# Altium schematic sheet 11_WIFI_BLE_Module.SchDoc: WIFI_BLE_Module
size 420 x 297 mm; Author: Lukas Henkel; DocumentNumber: 11; SheetNumber: 11; SheetTotal: 16; DocSize: A3
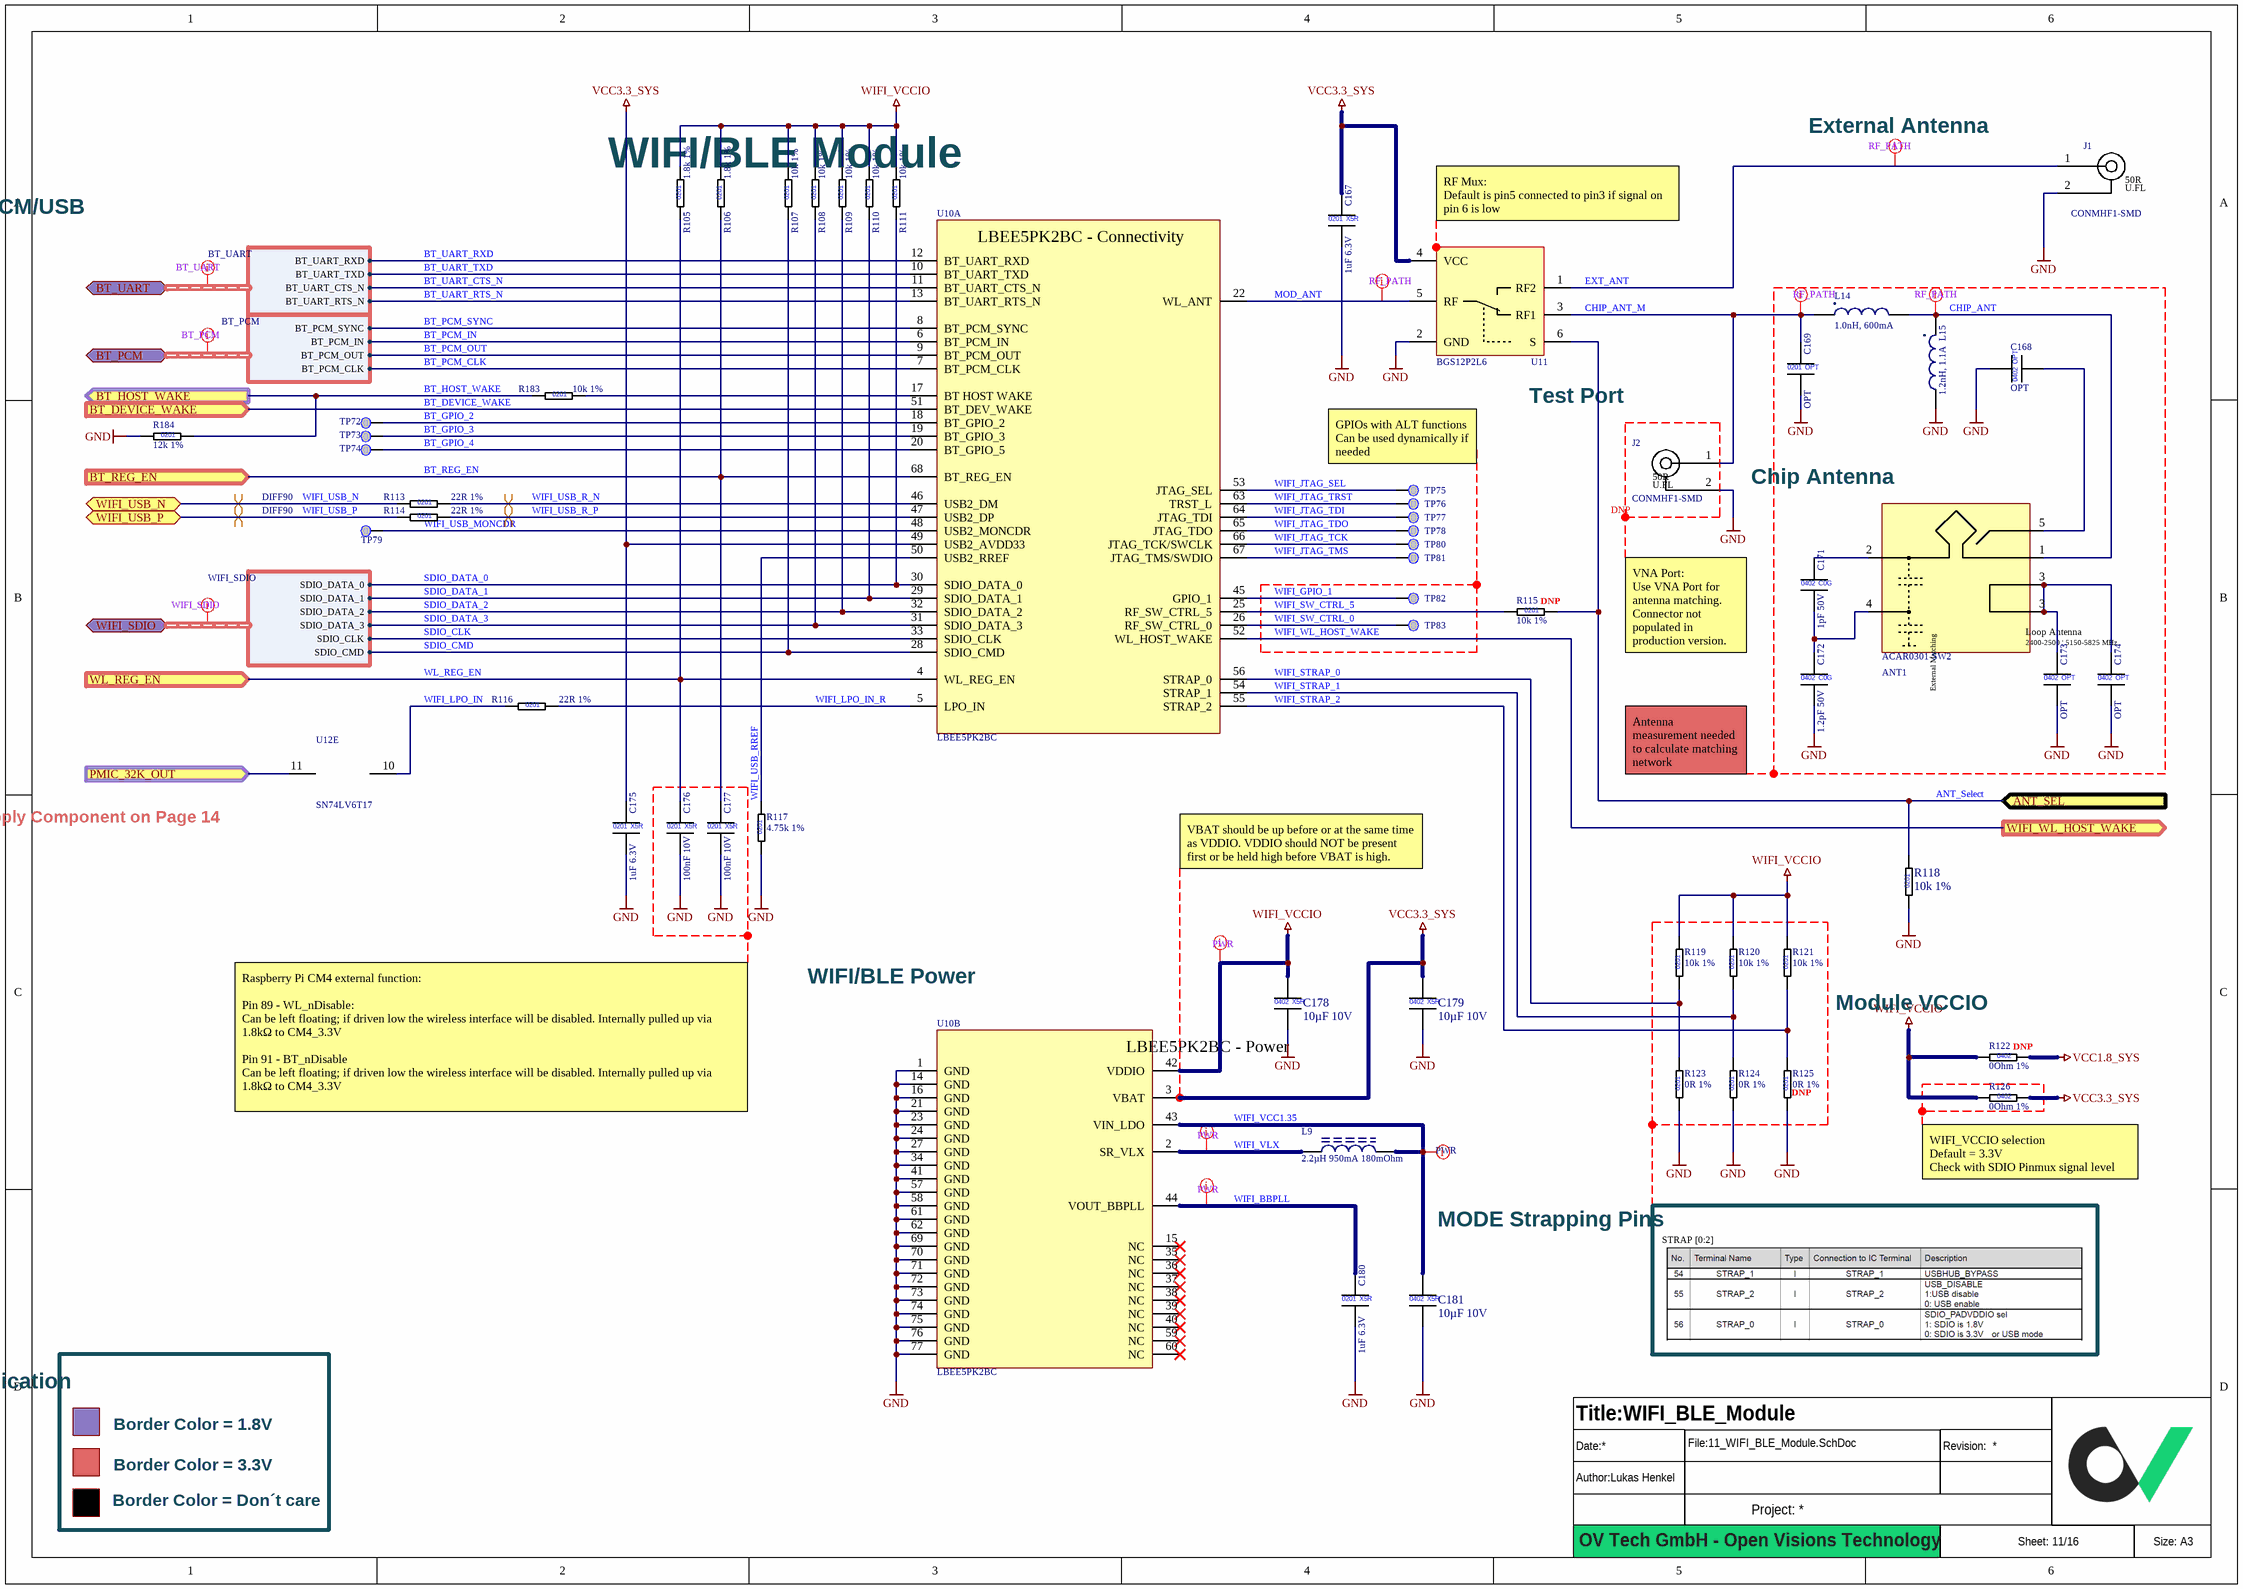
[diagram p0: 11_WIFI_BLE_Module.SchDoc]

## Parts
?  (no value)  (graphical)
ANT1  ACAR0301-SW2  [ANTENNA_ACAR0301-SW2]
C167  1uF 6.3V  [CAPC0603X03L]
C168  OPT  [CAPC1005X06L]  (no BOM)
C169  OPT  [CAPC0603X03L]  (no BOM)
C171  1pF 50V  [CAPC1005X06L]
C172  1.2pF 50V  [CAPC1005X06L]
C173  OPT  [CAPC1005X06L]  (no BOM)
C174  OPT  [CAPC1005X06L]  (no BOM)
C175  1uF 6.3V  [CAPC0603X03L]
C176  100nF 10V  [CAPC0603X03L]
C177  100nF 10V  [CAPC0603X03L]
C178  10µF 10V  [CAPC1005X06L]
C179  10µF 10V  [CAPC1005X06L]
C180  1uF 6.3V  [CAPC0603X03L]
C181  10µF 10V  [CAPC1005X06L]
J1  CONMHF1-SMD  [U.FL Jack SMD]
J2  CONMHF1-SMD  [U.FL Jack SMD]  (no BOM)
L9  2.2µH 950mA 180mOhm  [INDC2012X10L]
L14  1.0nH, 600mA  [INDC0603X03L]
L15  1.2nH, 1.1A  [INDC0603X03L]
R105  1.8k 1%  [RESC0603X03L]
R106  1.8k 1%  [RESC0603X03L]
R107  10k 1%  [RESC0603X03L]
R108  10k 1%  [RESC0603X03L]
R109  10k 1%  [RESC0603X03L]
R110  10k 1%  [RESC0603X03L]
R111  10k 1%  [RESC0603X03L]
R113  22R 1%  [RESC0603X03L]
R114  22R 1%  [RESC0603X03L]
R115  10k 1%  [RESC0603X03L]
R116  22R 1%  [RESC0603X03L]
R117  4.75k 1%  [RESC0603X03L]
R118  10k 1%  [RESC0603X03L]
R119  10k 1%  [RESC0603X03L]
R120  10k 1%  [RESC0603X03L]
R121  10k 1%  [RESC0603X03L]
R122  0Ohm 1%  [RESC1005X04L]
R123  0R 1%  [RESC0603X03L]
R124  0R 1%  [RESC0603X03L]
R125  0R 1%  [RESC0603X03L]
R126  0Ohm 1%  [RESC1005X04L]
R183  10k 1%  [RESC0603X03L]
R184  12k 1%  [RESC0603X03L]
TP72  Testpoint 0.5mm  [TP_0.50mm]  (value not drawn)  (no BOM)
TP73  Testpoint 0.5mm  [TP_0.50mm]  (value not drawn)  (no BOM)
TP74  Testpoint 0.5mm  [TP_0.50mm]  (value not drawn)  (no BOM)
TP75  Testpoint 0.5mm  [TP_0.50mm]  (value not drawn)  (no BOM)
TP76  Testpoint 0.5mm  [TP_0.50mm]  (value not drawn)  (no BOM)
TP77  Testpoint 0.5mm  [TP_0.50mm]  (value not drawn)  (no BOM)
TP78  Testpoint 0.5mm  [TP_0.50mm]  (value not drawn)  (no BOM)
TP79  Testpoint 0.5mm  [TP_0.50mm]  (value not drawn)  (no BOM)
TP80  Testpoint 0.5mm  [TP_0.50mm]  (value not drawn)  (no BOM)
TP81  Testpoint 0.5mm  [TP_0.50mm]  (value not drawn)  (no BOM)
TP82  Testpoint 0.5mm  [TP_0.50mm]  (value not drawn)  (no BOM)
TP83  Testpoint 0.5mm  [TP_0.50mm]  (value not drawn)  (no BOM)
U10  LBEE5PK2BC  [WIFI-BLE Module_LBEE5PK2BC]  (parts A,B of 2)
U11  BGS12P2L6  [PSON40P70X32-6N]
U12  SN74LV6T17  [QFN50P250X300X80_HS-13L]  (part E of 7)

## Blocks framed on the sheet
Chip Antenna: ANT1 C168 C169 C171-C174 L14 L15
DNP: J2
DNP: R119-R121 R123-R125

## Ports
ANT_SEL (in), BT_DEVICE_WAKE (in), BT_HOST_WAKE (out), BT_PCM (bidir, harness BT_PCM), BT_REG_EN (in), BT_UART (bidir, harness BT_UART), PMIC_32K_OUT (in), WIFI_SDIO (bidir, harness WIFI_SDIO), WIFI_USB_N (bidir), WIFI_USB_P (bidir), WIFI_WL_HOST_WAKE (out), WL_REG_EN (in)

## Harnesses
BT_UART: BT_UART_TXD, BT_UART_RXD, BT_UART_RTS_N, BT_UART_CTS_N
BT_PCM: BT_PCM_SYNC, BT_PCM_IN, BT_PCM_OUT, BT_PCM_CLK
WIFI_SDIO: SDIO_DATA_1, SDIO_DATA_0, SDIO_DATA_3, SDIO_DATA_2, SDIO_CMD, SDIO_CLK

## Nets
GND: C167.2 C168.1 C169.2 C172.2 C173.2 C174.2 C175.2 C176.2 C177.2 C178.2 C179.2 C180.2 C181.2 J1.2 J2.2 L15.2 R117.1 R118.1 R123.1 R124.1 R125.1 R184.1 U10.1(GND) U10.14(GND) U10.16(GND) U10.21(GND) U10.23(GND) U10.24(GND) U10.27(GND) U10.34(GND) U10.41(GND) U10.57(GND) U10.58(GND) U10.61(GND) U10.62(GND) U10.69(GND) U10.70(GND) U10.71(GND) U10.72(GND) U10.73(GND) U10.74(GND) U10.75(GND) U10.76(GND) U10.77(GND) U11.2(GND)
VCC1.8_SYS: R122.2
VCC3.3_SYS: C167.1 C175.1 C179.1 R126.2 U10.3(VBAT) U10.49(USB2_AVDD33) U11.4(VCC)
WIFI_VCCIO: C178.1 R105.2 R106.2 R107.2 R108.2 R109.2 R110.2 R111.2 R119.2 R120.2 R121.2 R122.1 R126.1 U10.42(VDDIO)
ANT_Select: R115.2 R118.2 U11.6(S) ; port ANT_SEL
BT_DEVICE_WAKE: U10.51(BT_DEV_WAKE) ; port BT_DEVICE_WAKE
BT_GPIO_2: TP72.TP U10.18(BT_GPIO_2)
BT_GPIO_3: TP73.TP U10.19(BT_GPIO_3)
BT_GPIO_4: TP74.TP U10.20(BT_GPIO_5)
BT_HOST_WAKE: R183.1 R184.2 ; port BT_HOST_WAKE
BT_PCM_CLK: U10.7(BT_PCM_CLK) ; port BT_PCM.BT_PCM_CLK
BT_PCM_IN: U10.6(BT_PCM_IN) ; port BT_PCM.BT_PCM_IN
BT_PCM_OUT: U10.9(BT_PCM_OUT) ; port BT_PCM.BT_PCM_OUT
BT_PCM_SYNC: U10.8(BT_PCM_SYNC) ; port BT_PCM.BT_PCM_SYNC
BT_REG_EN: C177.1 R106.1 U10.68(BT_REG_EN) ; port BT_REG_EN
BT_UART_CTS_N: U10.11(BT_UART_CTS_N) ; port BT_UART.BT_UART_CTS_N
BT_UART_RTS_N: U10.13(BT_UART_RTS_N) ; port BT_UART.BT_UART_RTS_N
BT_UART_RXD: U10.12(BT_UART_RXD) ; port BT_UART.BT_UART_RXD
BT_UART_TXD: U10.10(BT_UART_TXD) ; port BT_UART.BT_UART_TXD
CHIP_ANT: ANT1.1 L14.2 L15.1
CHIP_ANT_M: C169.1 J2.1 L14.1 U11.3(RF1)
EXT_ANT: J1.1 U11.1(RF2)
MOD_ANT: U10.22(WL_ANT) U11.5(RF)
PMIC_32K_OUT: U12.11(5A) ; port PMIC_32K_OUT
SDIO_CLK: U10.33(SDIO_CLK) ; port WIFI_SDIO.SDIO_CLK
SDIO_CMD: R107.1 U10.28(SDIO_CMD) ; port WIFI_SDIO.SDIO_CMD
SDIO_DATA_0: R111.1 U10.30(SDIO_DATA_0) ; port WIFI_SDIO.SDIO_DATA_0
SDIO_DATA_1: R110.1 U10.29(SDIO_DATA_1) ; port WIFI_SDIO.SDIO_DATA_1
SDIO_DATA_2: R109.1 U10.32(SDIO_DATA_2) ; port WIFI_SDIO.SDIO_DATA_2
SDIO_DATA_3: R108.1 U10.31(SDIO_DATA_3) ; port WIFI_SDIO.SDIO_DATA_3
WIFI_BBPLL: C180.1 U10.44(VOUT_BBPLL)
WIFI_GPIO_1: TP82.TP U10.45(GPIO_1)
WIFI_JTAG_SEL: TP75.TP U10.53(JTAG_SEL)
WIFI_JTAG_TCK: TP80.TP U10.66(JTAG_TCK/SWCLK)
WIFI_JTAG_TDI: TP77.TP U10.64(JTAG_TDI)
WIFI_JTAG_TDO: TP78.TP U10.65(JTAG_TDO)
WIFI_JTAG_TMS: TP81.TP U10.67(JTAG_TMS/SWDIO)
WIFI_JTAG_TRST: TP76.TP U10.63(TRST_L)
WIFI_LPO_IN: R116.1 U12.10(5Y)
WIFI_LPO_IN_R: R116.2 U10.5(LPO_IN)
WIFI_STRAP_0: R119.1 R123.2 U10.56(STRAP_0)
WIFI_STRAP_1: R120.1 R124.2 U10.54(STRAP_1)
WIFI_STRAP_2: R121.1 R125.2 U10.55(STRAP_2)
WIFI_SW_CTRL_0: TP83.TP U10.26(RF_SW_CTRL_0)
WIFI_SW_CTRL_5: R115.1 U10.25(RF_SW_CTRL_5)
WIFI_USB_MONCDR: TP79.TP U10.48(USB2_MONCDR)
WIFI_USB_N: R113.1 ; port WIFI_USB_N
WIFI_USB_P: R114.1 ; port WIFI_USB_P
WIFI_USB_R_N: R113.2 U10.46(USB2_DM)
WIFI_USB_R_P: R114.2 U10.47(USB2_DP)
WIFI_USB_RREF: R117.2 U10.50(USB2_RREF)
WIFI_VCC1.35: C181.1 L9.2 U10.43(VIN_LDO)
WIFI_VLX: L9.1 U10.2(SR_VLX)
WIFI_WL_HOST_WAKE: U10.52(WL_HOST_WAKE) ; port WIFI_WL_HOST_WAKE
WL_REG_EN: C176.1 R105.1 U10.4(WL_REG_EN) ; port WL_REG_EN
NetANT1_2: ANT1.2 C171.1
NetANT1_3: ANT1.3 C173.1 C174.1
NetANT1_4: ANT1.4 C171.2 C172.1
NetANT1_5: ANT1.5 C168.2
NetR183_2: R183.2 U10.17(BT_HOST_WAKE)

Not connected (* = marked no-connect by the designer): U10 15(NC)* 35(NC)* 36(NC)* 37(NC)* 38(NC)* 39(NC)* 40(NC)* 59(NC)* 60(NC)*

## Layout directives
net class RF_PATH: CHIP_ANT, CHIP_ANT_M, EXT_ANT, MOD_ANT
net class PWR: WIFI_BBPLL, WIFI_VCC1.35, WIFI_VCCIO, WIFI_VLX
differential pair; differential pair class DIFF90: WIFI_USB_N, WIFI_USB_P, WIFI_USB_R_N, WIFI_USB_R_P
net class BT_UART: (no net found under the mark)
net class BT_PCM: (no net found under the mark)
net class WIFI_SDIO: (no net found under the mark)

## Notes on the sheet
- (near J1) External Antenna
- WIFI/BLE Module
- UART/SDIO/PCM/USB
- (near U11) RF Mux:
  Default is pin5 connected to pin3 if signal on pin 6 is low
- Test Port
- GPIOs with ALT functions
  Can be used dynamically if needed
- (near R115) DNP
- VNA Port:
  Use VNA Port for antenna matching. Connector not populated in production version.
- Antenna measurement needed to calculate matching network
- (near U12) Supply Component on Page 14
- VBAT should be up before or at the same time as VDDIO. VDDIO should NOT be present first or be held high before VBAT is high.
- WIFI/BLE Power
- (near R122) Module VCCIO
- (near R122) DNP
- Raspberry Pi CM4 external function:
  Pin 89 - WL_nDisable:
  Can be left floating; if driven low the wireless interface will be disabled. Internally pulled up via 1.8kΩ to CM4_3.3V
  Pin 91 - BT_nDisable
  Can be left floating; if driven low the wireless interface will be disabled. Internally pulled up via 1.8kΩ to CM4_3.3V
- (near R126) WIFI_VCCIO selection
  Default = 3.3V
  Check with SDIO Pinmux signal level
- MODE Strapping Pins
- STRAP [0:2]
- Signal Level Indication
- Border Color = 1.8V
- Border Color = 3.3V
- Border Color = Don´t care
- OV Tech GmbH - Open Visions Technology
- (in symbol CAP_0201_1uF_6.3V) 0201; X5R
- (in symbol CAP_0201_100nF_10V) 0201; X5R
- (in symbol CAP_0201_OPT) 0201
- (in symbol CAP_0402_1.2pF_50V) 0402; C0G
- (in symbol CAP_0402_1pF_50V) 0402; C0G
- (in symbol CAP_0402_10µ_10V) 0402; X5R
- (in symbol CAP_0402_OPT) 0402
- (in symbol Chip Antenna_ACAR0301-SW2) External Matching; Loop Antenna; 2400-2500 | 5150-5825 MHz
- (in symbol RES_0201_0R_1%) 0201
- (in symbol RES_0201_1.8k_1%) 0201
- (in symbol RES_0201_4.75k_1%) 0201
- (in symbol RES_0201_10k_1%) 0201
- (in symbol RES_0201_12k_1%) 0201
- (in symbol RES_0201_22R_1%) 0201
- (in symbol RES_0402_0R_1%) 0402
- (in symbol U.FL_CONMHF1-SMD) 50R; U.FL
- (in symbol WIFI_BLE_Module_LBEE5PK2BC, part A) LBEE5PK2BC - Connectivity
- (in symbol WIFI_BLE_Module_LBEE5PK2BC, part B) LBEE5PK2BC - Power

## Library data of the parts
? = Titleblock_01_OpenSource
ANT1 = Chip Antenna_ACAR0301-SW2: Ceramic Chip Antenna ACAR0301-SW2 2.4 - 5.825GHZ; Manufacturer 1: ABRACON; Manufacturer 1 Prt. Nr.: ACAR0301-SW2
C167 C175 C180 = CAP_0201_1uF_6.3V: Multilayer Ceramic Capacitors MLCC - SMD/SMT 0201 6.3VDC; Manufacturer 1: Murata Electronics; Manufacturer 1 Prt. Nr.: GRM033R60J105MEA2D; Manufacturer 2 Prt. Nr.: CL03A105MQ3CSNC; Manufacturer 2: Samsung Electro-Mechanics
C168 C173 C174 = CAP_0402_OPT: Optional Capacitor 0402
C169 = CAP_0201_OPT: Optional Capacitor 0201
C171 = CAP_0402_1pF_50V: Multilayer Ceramic Capacitors MLCC - SMD/SMT 0402 50VDC; Manufacturer 1: Murata Electronics; Manufacturer 1 Prt. Nr.: GJM1555C1H1R0BB01J; Manufacturer 2 Prt. Nr.: CBR04C109A5GAC; Manufacturer 2: KEMET
C172 = CAP_0402_1.2pF_50V: Multilayer Ceramic Capacitors MLCC - SMD/SMT 0402 50VDC; Manufacturer 1: Murata Electronics; Manufacturer 1 Prt. Nr.: GJM1555C1H1R2CB01D; Manufacturer 2 Prt. Nr.: CBR04C129A5GAC; Manufacturer 2: KEMET
C176 C177 = CAP_0201_100nF_10V: Multilayer Ceramic Capacitors MLCC - SMD/SMT 0201 10VDC; Manufacturer 1: Murata Electronics; Manufacturer 1 Prt. Nr.: GRT033R61A104KE01J; Manufacturer 2 Prt. Nr.: CL03A104MP3NNNC; Manufacturer 2: Samsung Electro-Mechanics
C178 C179 C181 = CAP_0402_10µ_10V: Multilayer Ceramic Capacitors MLCC - SMD/SMT 0402 10VDC; Manufacturer 1: Murata Electronics; Manufacturer 1 Prt. Nr.: GRM155R61A106ME11D; Manufacturer 2 Prt. Nr.: 0402ZD106MAT4A; Manufacturer 2: KYOCERA AVX
J1 J2 = U.FL_CONMHF1-SMD: U.FL Type Jack PCB SMD RF Connector; Manufacturer 1: Linx Technologies; Manufacturer 1 Prt. Nr.: CONMHF1-SMD
L9 = IND_LQM21_2.2µH_950mA: Fixed Inductors LQM21 2.2uH 950mA 20% 180mOhms; Manufacturer 1 Prt. Nr.: LQM21PN2R2MGSD; Manufacturer 1: Murata Electronics
L14 = HF_INDC_0201_1.0nH_600mA: 0201 HF Inductor; Manufacturer 1 Prt. Nr.: AIMC-06UHQ-1N0B-T; Manufacturer 1: Abracon; Manufacturer 2 Prt. Nr.: MLG0603S1N0BTD25; Manufacturer 2: TDK
L15 = HF_INDC_0201_1.2nH_1.1A: 0201 HF Inductor; Manufacturer 1 Prt. Nr.: AIMC-06UHQ-1N2B-T; Manufacturer 1: Abracon; Manufacturer 2 Prt. Nr.: LQP03HQ1N2C02D; Manufacturer 2: Murata
R105 R106 = RES_0201_1.8k_1%: Thick Film Resistors - SMD 1.8K OHM 1%; Manufacturer 1: Panasonic; Manufacturer 1 Prt. Nr.: ERJ-1GNF1801C; Manufacturer 2 Prt. Nr.: CRCW02011K80FKED; Manufacturer 2: Vishay / Dale
R107-R111 R115 R118-R121 R183 = RES_0201_10k_1%: Thick Film Resistors - SMD 10K OHM 1%; Manufacturer 1: Yageo; Manufacturer 1 Prt. Nr.: RC0201FR-0710KL; Manufacturer 2 Prt. Nr.: CRCW020110K0FNED; Manufacturer 2: Vishay / Dale
R113 R114 R116 = RES_0201_22R_1%: Thick Film Resistors - SMD 22R OHM 1%; Manufacturer 1: Yageo; Manufacturer 1 Prt. Nr.: RC0201FR-0722RL; Manufacturer 2 Prt. Nr.: CRCW020122R0FNED; Manufacturer 2: Vishay / Dale
R117 = RES_0201_4.75k_1%: Thick Film Resistors - SMD 4.75K OHM 1%; Manufacturer 1: Yageo; Manufacturer 1 Prt. Nr.: AC0201FR-074K75L; Manufacturer 2 Prt. Nr.: CRCW02014K75FNED; Manufacturer 2: Vishay / Dale
R122 R126 = RES_0402_0R_1%: Thick Film Resistors - SMD 0OHM 1%; Manufacturer 1: Bourns; Manufacturer 1 Prt. Nr.: CR0402AJ/-000GAS; Manufacturer 2 Prt. Nr.: AC0402FR-070RL; Manufacturer 2: YAGEO
R123-R125 = RES_0201_0R_1%: Thick Film Resistors - SMD 0R OHM 1%; Manufacturer 1: Yageo; Manufacturer 1 Prt. Nr.: RC0201FR-070RL; Manufacturer 2 Prt. Nr.: CRCW02010000Z0ED; Manufacturer 2: Vishay / Dale
R184 = RES_0201_12k_1%: Thick Film Resistors - SMD 12K OHM 1%; Manufacturer 1: Yageo; Manufacturer 1 Prt. Nr.: RC0201FR-0712KL; Manufacturer 2 Prt. Nr.: CRCW020112K0FKED; Manufacturer 2: Vishay / Dale
U10 = WIFI_BLE_Module_LBEE5PK2BC: Shielded Ultra Small Wi-Fi® 11a/b/g/n/ac + Bluetooth® 5.2 Module2.4GHz/5GHz Wi-Fi® + Bluetooth® Module; Manufacturer 1: Murata; Manufacturer 1 Prt. Nr.: LBEE5PK2BC; Temperature Range: -20°C - 70°C
U11 = RF Analog SW 2:1_BGS12P2L6: SPDT 2-channel analog multiplexer/demultiplexer EF 6GHz Bandwidth; Manufacturer 1: Infineon; Manufacturer 1 Prt. Nr.: BGS12P2L6E6327XTSA1
U12 = Hex_Schmitt-Buffer_LvL-Shift_SN74LV6T17: Hex Schmitt-Trigger Buffer with Integrated Translation; Manufacturer 1: NXP Semiconductors; Manufacturer 1 Prt. Nr.: SN74LV6T17BQAR